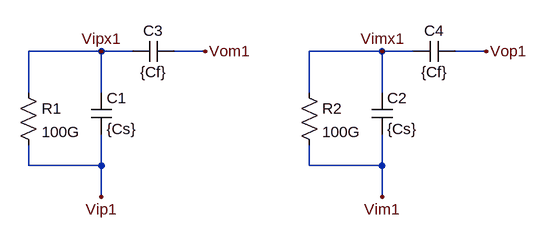
[diagram p0: schematic Draft11.asc]
Draft11.asc, the LTspice schematic file:
Version 4
SHEET 1 880 680
WIRE -304 -112 -416 -112
WIRE -256 -112 -304 -112
WIRE -144 -112 -192 -112
WIRE 128 -112 16 -112
WIRE 176 -112 128 -112
WIRE 288 -112 240 -112
WIRE -416 -48 -416 -112
WIRE -304 -48 -304 -112
WIRE 16 -48 16 -112
WIRE 128 -48 128 -112
WIRE -416 64 -416 32
WIRE -304 64 -304 16
WIRE -304 64 -416 64
WIRE 16 64 16 32
WIRE 128 64 128 16
WIRE 128 64 16 64
WIRE -304 112 -304 64
WIRE 128 112 128 64
FLAG -304 112 Vip1
FLAG -144 -112 Vom1
FLAG -304 -112 Vipx1
FLAG 128 112 Vim1
FLAG 288 -112 Vop1
FLAG 128 -112 Vimx1
SYMBOL res -432 -64 R0
SYMATTR InstName R1
SYMATTR Value 100G
SYMBOL res 0 -64 R0
SYMATTR InstName R2
SYMATTR Value 100G
SYMBOL cap -320 -48 R0
SYMATTR InstName C1
SYMATTR Value {Cs}
SYMBOL cap 112 -48 R0
SYMATTR InstName C2
SYMATTR Value {Cs}
SYMBOL cap -192 -128 R90
WINDOW 0 0 32 VBottom 2
WINDOW 3 32 32 VTop 2
SYMATTR InstName C3
SYMATTR Value {Cf}
SYMBOL cap 240 -128 R90
WINDOW 0 0 32 VBottom 2
WINDOW 3 32 32 VTop 2
SYMATTR InstName C4
SYMATTR Value {Cf}

The netlist it stands for:
* Draft11.asc
R1 Vipx1 Vip1 100G
R2 Vimx1 Vim1 100G
C1 Vipx1 Vip1 {Cs}
C2 Vimx1 Vim1 {Cs}
C3 Vom1 Vipx1 {Cf}
C4 Vop1 Vimx1 {Cf}
.backanno
.end